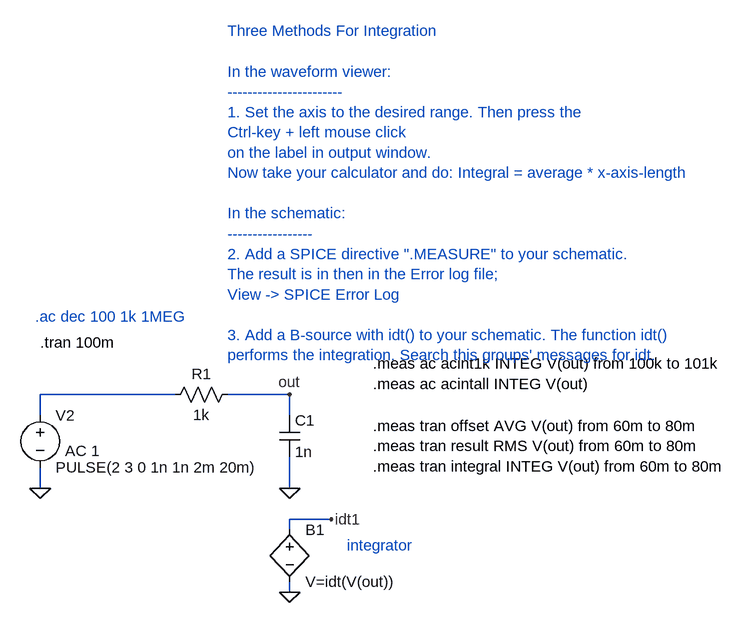
[diagram p0: schematic integration3.asc]
integration3.asc, the LTspice schematic file:
Version 4
SHEET 1 1324 680
WIRE -160 -112 -160 -144
WIRE -160 0 -160 -32
WIRE 48 -144 -160 -144
WIRE 224 -144 128 -144
WIRE 224 -112 224 -144
WIRE 224 0 224 -48
WIRE 224 64 224 48
WIRE 224 160 224 144
WIRE 288 48 224 48
FLAG -160 0 0
FLAG 224 -144 out
FLAG 224 0 0
FLAG 288 48 idt1
FLAG 224 160 0
SYMBOL voltage -160 -128 R0
WINDOW 123 38 71 Left 0
WINDOW 39 0 0 Left 0
SYMATTR Value2 AC 1
SYMATTR InstName V2
SYMATTR Value PULSE(2 3 0 1n 1n 2m 20m)
SYMBOL cap 208 -112 R0
SYMATTR InstName C1
SYMATTR Value 1n
SYMBOL res 32 -128 R270
WINDOW 0 32 56 VTop 0
WINDOW 3 0 56 VBottom 0
SYMATTR InstName R1
SYMATTR Value 1k
SYMBOL bv 224 48 R0
SYMATTR InstName B1
SYMATTR Value V=idt(V(out))
TEXT 352 -96 Left 0 !.meas tran offset AVG V(out) from 60m to 80m\n.meas tran result RMS V(out) from 60m to 80m\n.meas tran integral INTEG V(out) from 60m to 80m
TEXT -160 -224 Left 0 !.tran 100m
TEXT -168 -264 Left 0 ;.ac dec 100 1k 1MEG
TEXT 352 -192 Left 0 !.meas ac acint1k INTEG V(out) from 100k to 101k\n.meas ac acintall INTEG V(out)
TEXT 312 88 Left 0 ;integrator
TEXT 128 -704 Left 0 ;Three Methods For Integration\n \nIn the waveform viewer:\n-----------------------\n1. Set the axis to the desired range. Then press the \nCtrl-key + left mouse click   \non the label in output window. \nNow take your calculator and do: Integral = average * x-axis-length\n \nIn the schematic:\n-----------------\n2. Add a SPICE directive ".MEASURE" to your schematic.\nThe result is in then in the Error log file;  \nView -> SPICE Error Log\n \n3. Add a B-source with idt() to your schematic. The function idt() \nperforms the integration. Search this groups' messages for idt.

The netlist it stands for:
* integration3.asc
V2 N001 0 PULSE(2 3 0 1n 1n 2m 20m) AC 1
C1 out 0 1n
R1 N001 out 1k
B1 idt1 0 V=idt(V(out))
.meas tran offset AVG V(out) from 60m to 80m
.meas tran result RMS V(out) from 60m to 80m
.meas tran integral INTEG V(out) from 60m to 80m
.tran 100m
* .ac dec 100 1k 1MEG
.meas ac acint1k INTEG V(out) from 100k to 101k
.meas ac acintall INTEG V(out)
* integrator
* Three Methods For Integration
* In the waveform viewer:
* -----------------------
* 1. Set the axis to the desired range. Then press the
* Ctrl-key + left mouse click
* on the label in output window.
* Now take your calculator and do: Integral = average * x-axis-length
* In the schematic:
* -----------------
* 2. Add a SPICE directive ".MEASURE" to your schematic.
* The result is in then in the Error log file;
* View -> SPICE Error Log
* 3. Add a B-source with idt() to your schematic. The function idt()
* performs the integration. Search this groups' messages for idt.
.backanno
.end